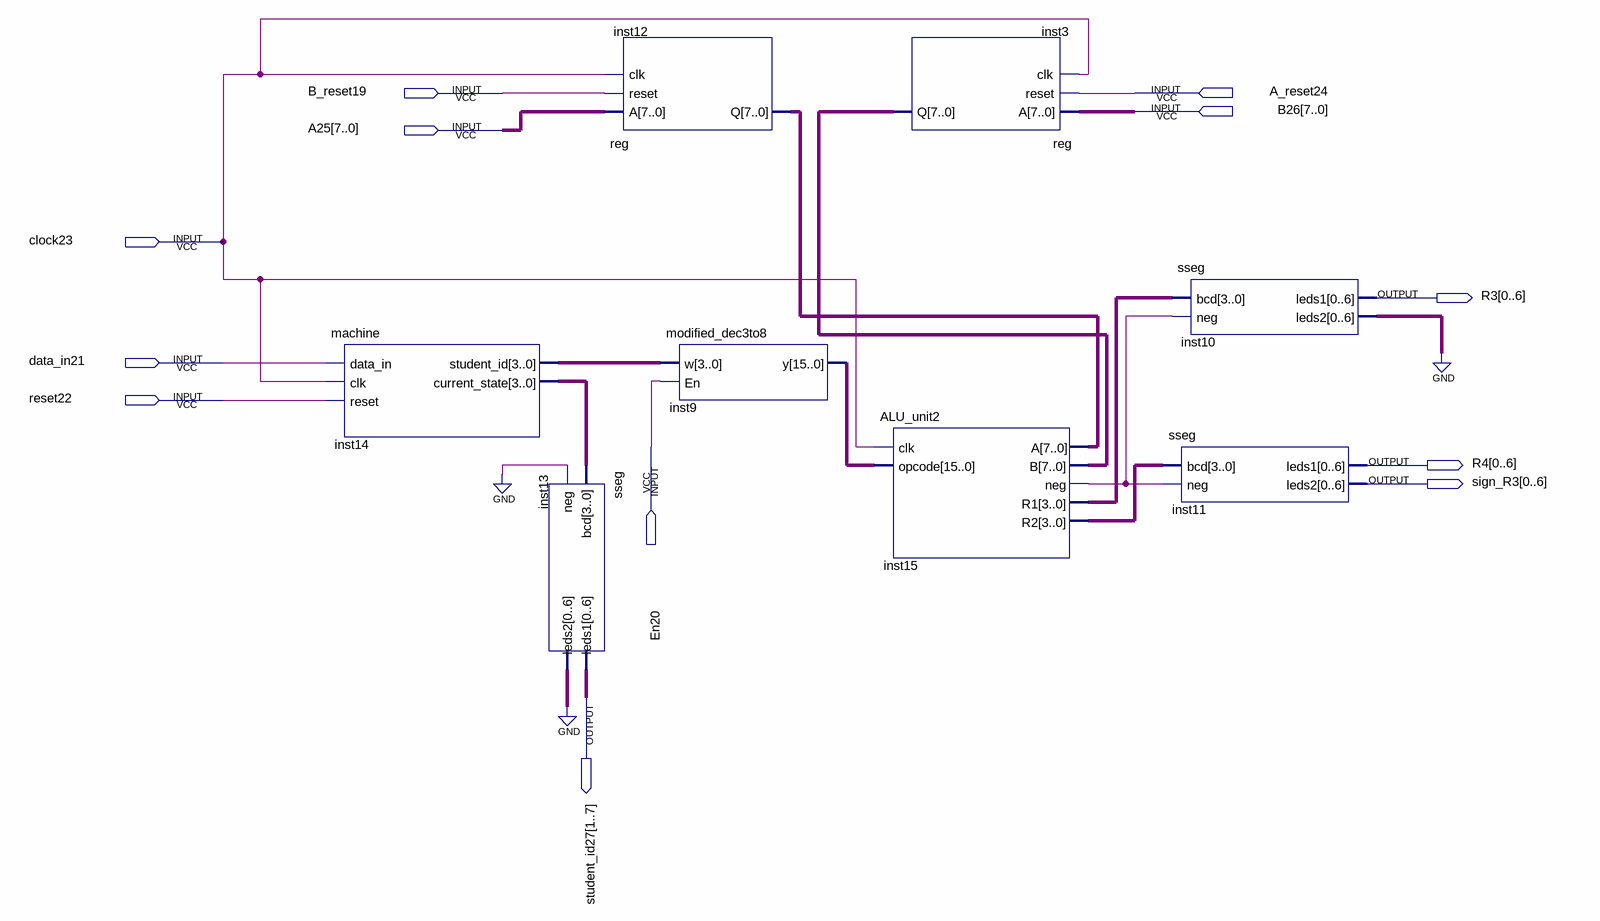
[diagram p0: schematic sheet]
// Quartus schematic ALU2.bdf as structural Verilog: 8 symbols, 12 pins
module ALU2 (
  input  B_reset19,
  input  A_reset24,
  input  [7:0] B26,
  input  [7:0] A25,
  input  clock23,
  input  data_in21,
  input  reset22,
  input  En20,
  output [0:6] R3,
  output [0:6] R4,
  output [0:6] sign_R3,
  output [1:7] student_id27
);

  wire inst15_neg;
  wire [3:0] inst14_current_state, inst14_student_id, inst15_r1, inst15_r2;
  wire [6:0] inst10_leds2, inst13_leds2;
  wire [7:0] inst3_q, inst12_q;
  wire [15:0] inst9_y;

  machine inst14 (
    .data_in(data_in21), .clk(clock23), .reset(reset22), .student_id(inst14_student_id),
    .current_state(inst14_current_state));
  sseg inst13 (.bcd(inst14_current_state), .neg(1'b0), .leds1(student_id27), .leds2(inst13_leds2));
  \reg  inst12 (.A(A25), .reset(B_reset19), .clk(clock23), .Q(inst12_q));
  modified_dec3to8 inst9 (.w(inst14_student_id), .En(En20), .y(inst9_y));
  \reg  inst3 (.A(B26), .reset(A_reset24), .clk(clock23), .Q(inst3_q));
  ALU_unit2 inst15 (
    .clk(clock23), .opcode(inst9_y), .neg(inst15_neg), .R1(inst15_r1), .R2(inst15_r2), .A(inst12_q),
    .B(inst3_q));
  sseg inst10 (.bcd(inst15_r1), .neg(inst15_neg), .leds1(R3), .leds2(inst10_leds2));
  sseg inst11 (.bcd(inst15_r2), .neg(inst15_neg), .leds1(R4), .leds2(sign_R3));
  // also tied to GND on the sheet: {inst10_leds2[0], inst10_leds2[1], inst10_leds2[2], inst10_leds2[3], inst10_leds2[4], inst10_leds2[5], inst10_leds2[6], inst13_leds2[0], inst13_leds2[1], inst13_leds2[2], inst13_leds2[3], inst13_leds2[4], inst13_leds2[5], inst13_leds2[6]}
endmodule
